# Altium schematic sheet Master.SchDoc
size A4; SheetNumber: 1; SheetTotal: 5
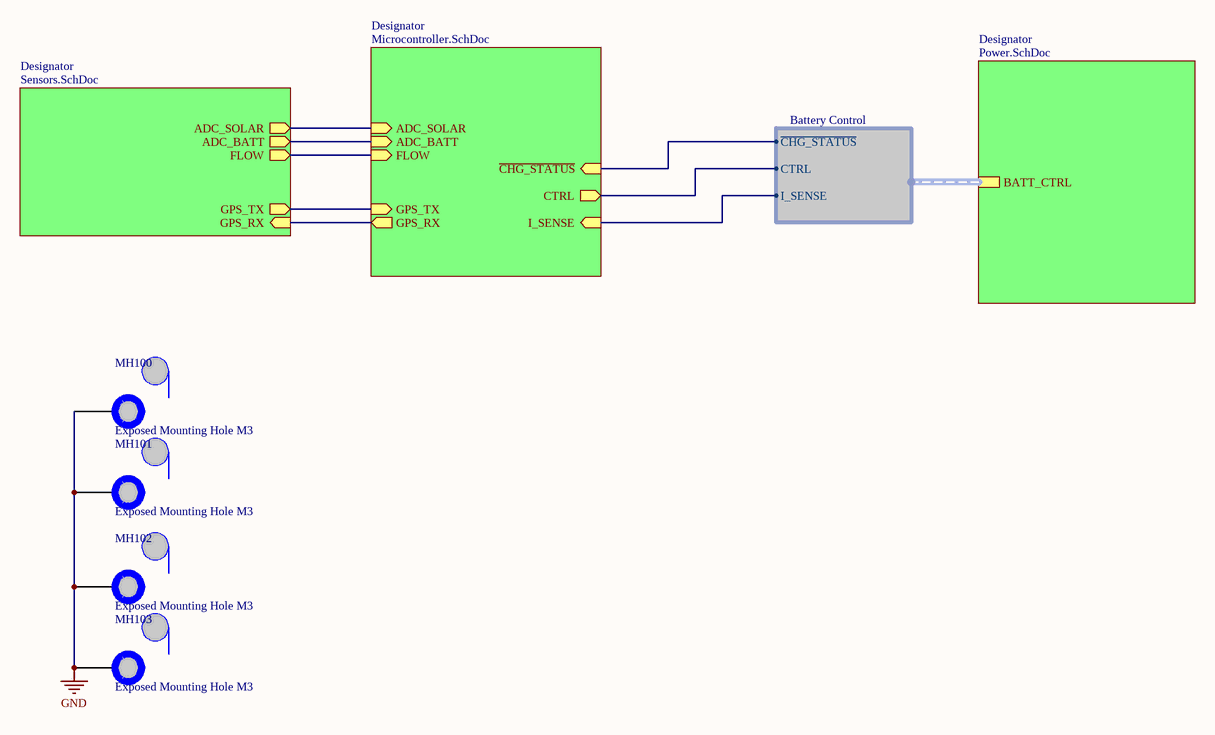
[diagram p0: Master.SchDoc]

## Parts
MH100  Exposed Mounting Hole M3  [Mounting Hole M3-Footprint-1]
MH101  Exposed Mounting Hole M3  [Mounting Hole M3-Footprint-1]
MH102  Exposed Mounting Hole M3  [Mounting Hole M3-Footprint-1]
MH103  Exposed Mounting Hole M3  [Mounting Hole M3-Footprint-1]

## Sub-sheets
Designator = Microcontroller.SchDoc: ADC_SOLAR (in), FLOW (in), ADC_BATT (in), GPS_RX (out), GPS_TX (in), CTRL (out), ~{CHG_STATUS} (in), I_SENSE (in)
Designator = Sensors.SchDoc: GPS_TX (out), FLOW (out), ADC_SOLAR (out), GPS_RX (in), ADC_BATT (out)
Designator = Power.SchDoc: BATT_CTRL (harness Battery Control)

## Harnesses
Battery Control: ~{CHG_STATUS}, CTRL, I_SENSE

## Nets
GND: MH100.0 MH101.0 MH102.0 MH103.0
(unnamed): sheet Designator/ADC_SOLAR, sheet Designator/ADC_SOLAR
(unnamed): sheet Designator/FLOW, sheet Designator/FLOW
(unnamed): sheet Designator/ADC_BATT, sheet Designator/ADC_BATT
(unnamed): sheet Designator/GPS_RX, sheet Designator/GPS_RX
(unnamed): sheet Designator/GPS_TX, sheet Designator/GPS_TX
(unnamed): sheet Designator/CTRL, sheet Designator/BATT_CTRL.CTRL
(unnamed): sheet Designator/~{CHG_STATUS}, sheet Designator/BATT_CTRL.~{CHG_STATUS}
(unnamed): sheet Designator/I_SENSE, sheet Designator/BATT_CTRL.I_SENSE

## Library data of the parts
MH100-MH103 = CMP-00028-00002-1: M3 Mounting Hole Exposed